# Altium schematic sheet Sheet2.SchDoc
size A4
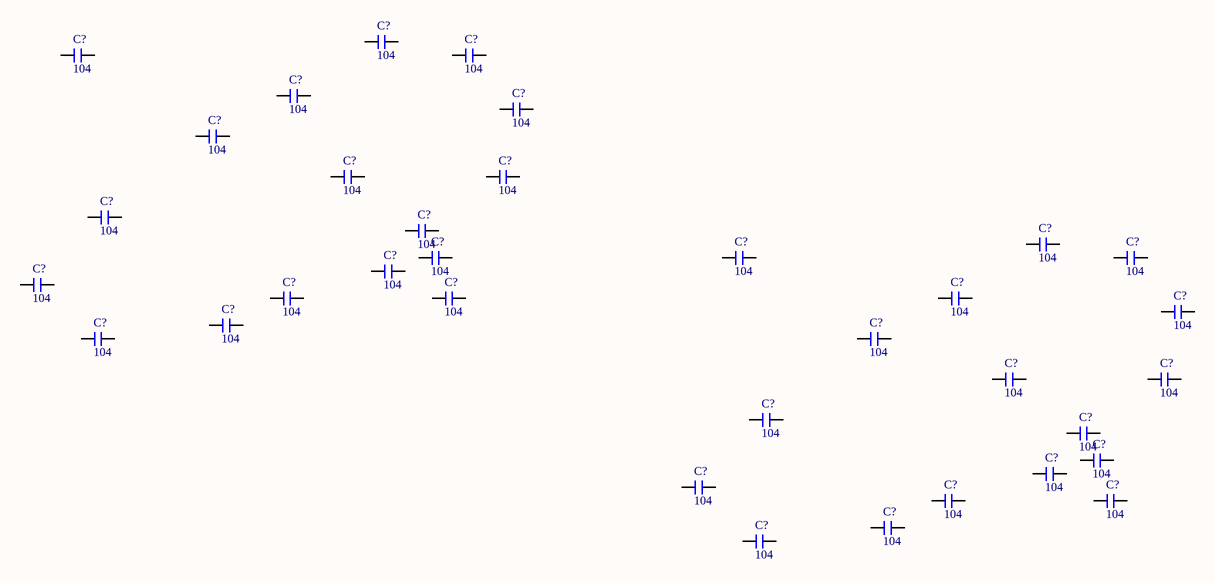
[diagram p0: Sheet2.SchDoc]

## Parts
(Parts that share a designator on the sheet are numbered #1, #2 ... from top to bottom, then left to right.)
C?#1  104  [C 0402_L]
C?#2  104  [C 0402_L]
C?#3  104  [C 0402_L]
C?#4  104  [C 0402_L]
C?#5  104  [C 0402_L]
C?#6  104  [C 0402_L]
C?#7  104  [C 0402_L]
C?#8  104  [C 0402_L]
C?#9  104  [C 0402_L]
C?#10  104  [C 0402_L]
C?#11  104  [C 0402_L]
C?#12  104  [C 0402_L]
C?#13  104  [C 0402_L]
C?#14  104  [C 0402_L]
C?#15  104  [C 0402_L]
C?#16  104  [C 0402_L]
C?#17  104  [C 0402_L]
C?#18  104  [C 0402_L]
C?#19  104  [C 0402_L]
C?#20  104  [C 0402_L]
C?#21  104  [C 0402_L]
C?#22  104  [C 0402_L]
C?#23  104  [C 0402_L]
C?#24  104  [C 0402_L]
C?#25  104  [C 0402_L]
C?#26  104  [C 0402_L]
C?#27  104  [C 0402_L]
C?#28  104  [C 0402_L]
C?#29  104  [C 0402_L]
C?#30  104  [C 0402_L]
C?#31  104  [C 0402_L]
C?#32  104  [C 0402_L]
C?#33  104  [C 0402_L]
C?#34  104  [C 0402_L]

## Nets

Not connected (* = marked no-connect by the designer): C?#1 1 2; C?#2 1 2; C?#3 1 2; C?#4 1 2; C?#5 1 2; C?#6 1 2; C?#7 1 2; C?#8 1 2; C?#9 1 2; C?#10 1 2; C?#11 1 2; C?#12 1 2; C?#13 1 2; C?#14 1 2; C?#15 1 2; C?#16 1 2; C?#17 1 2; C?#18 1 2; C?#19 1 2; C?#20 1 2; C?#21 1 2; C?#22 1 2; C?#23 1 2; C?#24 1 2; C?#25 1 2; C?#26 1 2; C?#27 1 2; C?#28 1 2; C?#29 1 2; C?#30 1 2; C?#31 1 2; C?#32 1 2; C?#33 1 2; C?#34 1 2

## Library data of the parts
C?#1-C?#34 = C: 贴片电容; BOM名称: 无极性贴片电容; 淘宝ID: 封装库来自淘宝 ID：黄晶宝石; 联系售后，技术支持: https://shop463601444.taobao.com; 唯一出售店铺网址: https://shop463601444.taobao.com